# EAGLE design WeMos-TIC (EAGLE 7.7.0)
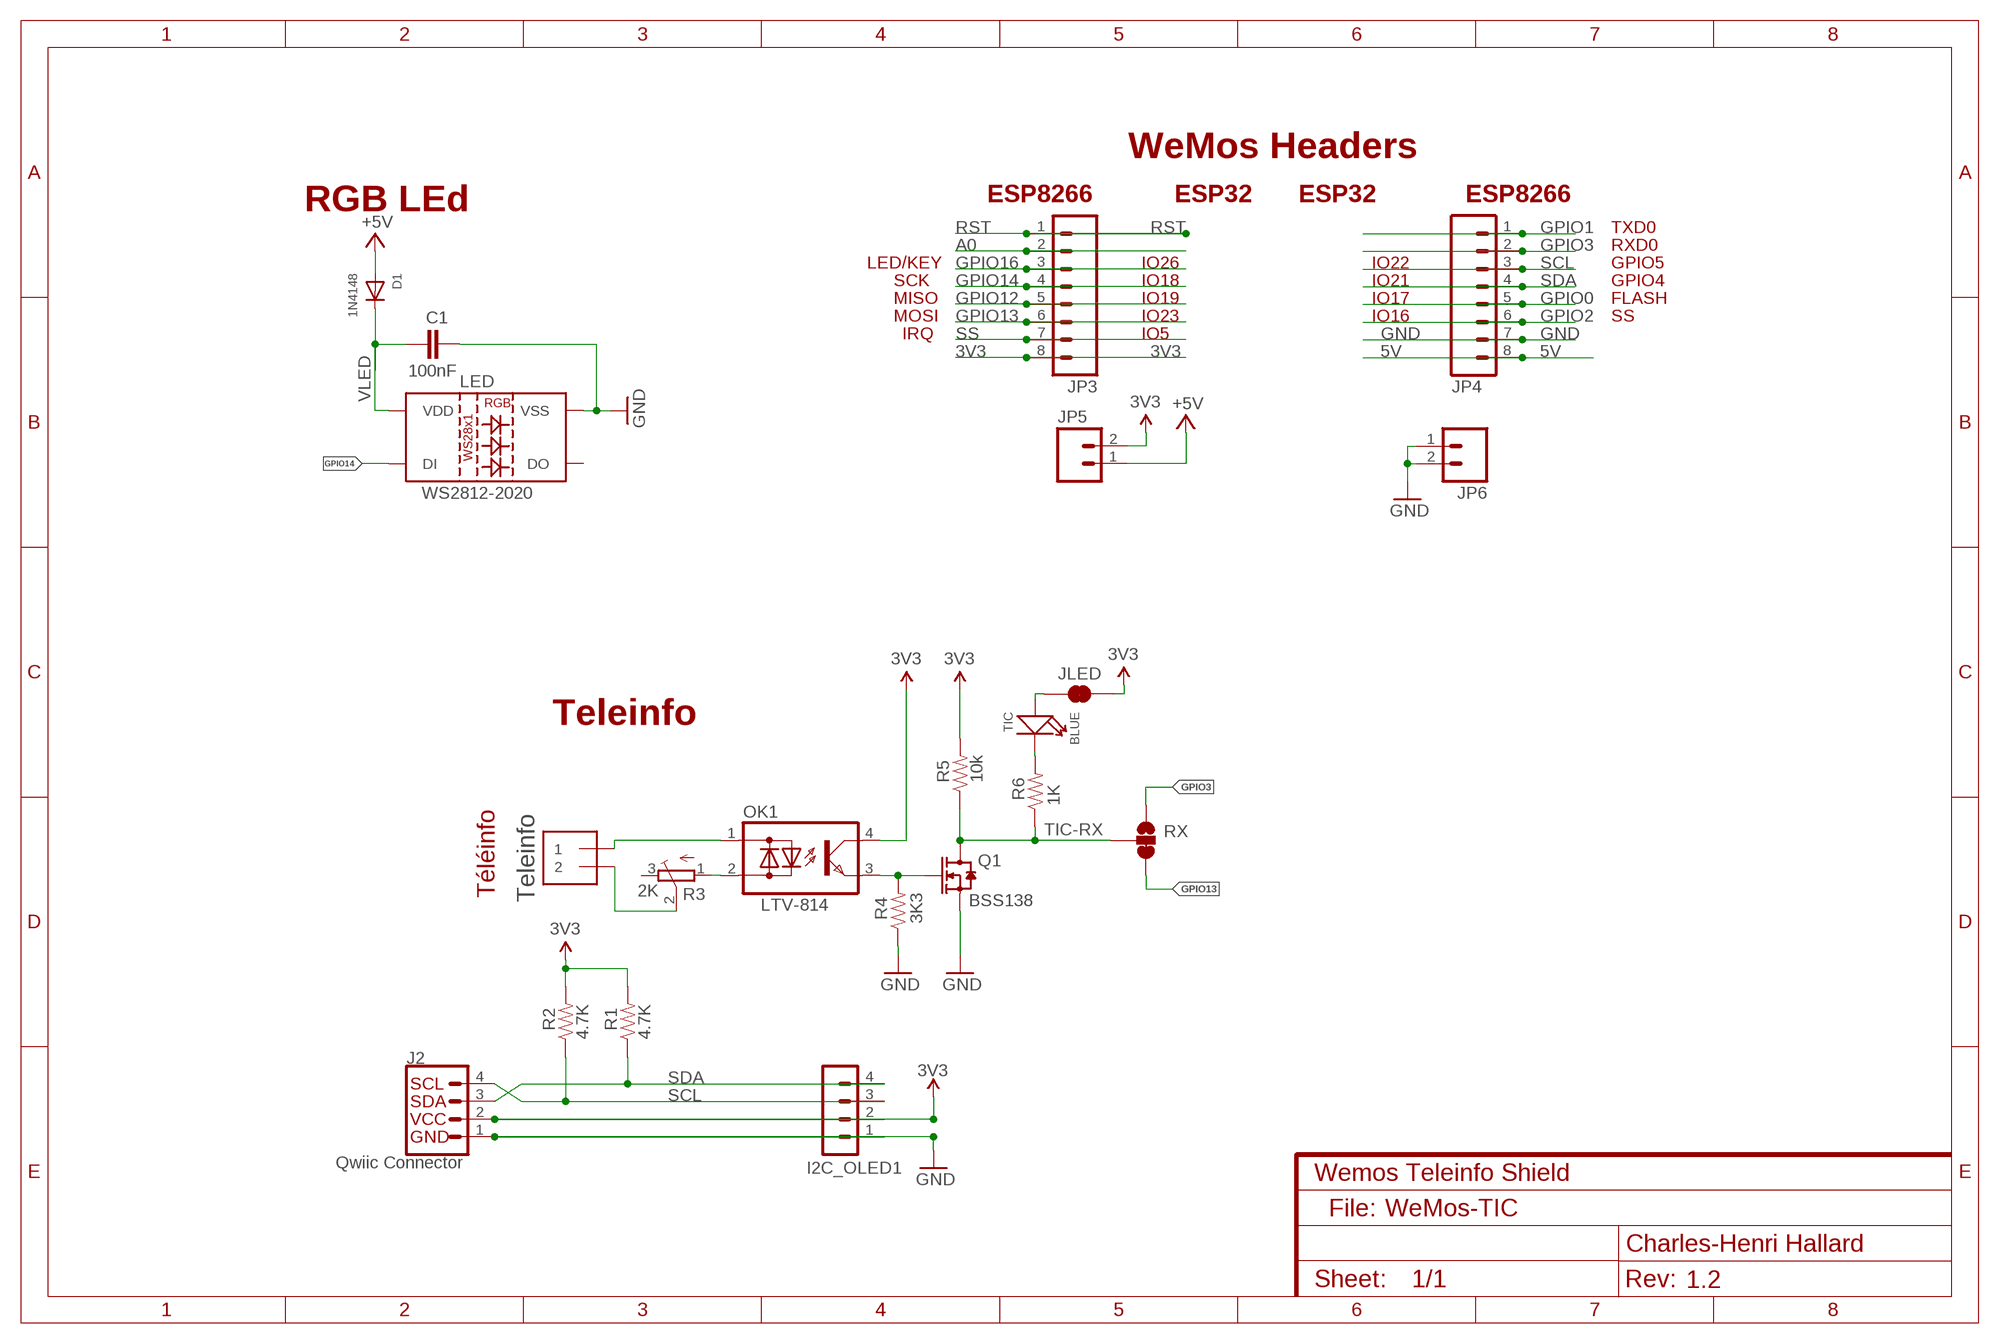
[diagram p0: schematic, sheet 1]
NAME (FRAME-A4L): CNAME: Wemos Teleinfo Shield; CREVISION: 1.2; DESIGNER: Charles-Henri Hallard

## Parts
C1  100nF  CAP0402-CAP-OK  [0402-CAP-OK]
D1  1N4148  DIODESOD-523  [SOD-523]
I2C_OLED1  CON_HEADER_1X04'SMALL''  [M1X4]
J1  KF2EDGR-3.81-2P  1X2-3.5MM-3.5MM  [1X2-3.5MM]
J2  Qwiic Connector  QWIIC_CONNECTOR  [JST04_1MM_VERT]
JLED  JUMPER-PAD-2-NC_BY_TRACE  [PAD-JUMPER-2-NC_BY_TRACE_YES_SILK]
JP3  M08NO_SILK_FEMALE_PTH  [1X08_NO_SILK]
JP4  M08NO_SILK_FEMALE_PTH  [1X08_NO_SILK]
JP5  M021X02_NO_SILK  [1X02_NO_SILK]
JP6  M021X02_NO_SILK  [1X02_NO_SILK]
LED  WS2812-2020  [WS2812-2020]
OK1  LTV-814  SFH6206  [DIL4-SMD]
Q1  BSS138  SMD-MOSFET-N-CH-20V-2.1A-CJ2302(SOT-23)  [SOT-323-3]
R1  4.7K  RESISTOR0402-RES  [0402-RES]
R2  4.7K  RESISTOR0402-RES  [0402-RES]
R3  2K  TRIMPOTTC33X  [TC33X]
R4  3K3  RESISTOR0402-RES  [0402-RES]
R5  10k  RESISTOR0402-RES  [0402-RES]
R6  1K  RESISTOR0402-RES  [0402-RES]
RX  TIC-RX  JUMPER-SMT_3_1-NC_TRACE_SILK  [SMT-JUMPER_3_1-NC_TRACE_SILK]
TIC  BLUE  SMD-LED-CLEAR-BLUE(0402)  [LED-0402]

## Nets
3V3: I2C_OLED1.2 J2.2 JLED.1 JP3.8 JP5.2 OK1.4(C) R1.2 R2.2 R5.2
5V: D1.A JP4.8 JP5.1 ; supply symbol labelled +5V
A0: JP3.2
GND: C1.1 I2C_OLED1.1 J2.1 JP4.7 JP6.1 JP6.2 LED.2(VSS) Q1.2(S) R4.1
GPIO0: JP4.5
GPIO1: JP4.1
GPIO2: JP4.6
GPIO3: JP4.2 RX.1
GPIO12: JP3.5
GPIO13: JP3.6 RX.3
GPIO14: JP3.4 LED.3(DI)
GPIO16: JP3.3
LTIC: JLED.2 TIC.+
N$1: R6.2 TIC.-
N$2: OK1.3(E) Q1.1(G) R4.2
N$3: OK1.2(AC2) R3.1(A)
N$4: J1.1 OK1.1(AC1)
N$5: J1.2 R3.2(S)
RST: JP3.1
SCL: I2C_OLED1.3 J2.4 JP4.3 R2.1
SDA: I2C_OLED1.4 J2.3 JP4.4 R1.1
SS: JP3.7
TIC-RX: Q1.3(D) R5.1 R6.1 RX.2
VLED: C1.2 D1.K(C) LED.4(VDD)
Unconnected: LED.1(DO) R3.3(E)

## Notes on the sheet
- WeMos Headers
- ESP8266 | ESP32 | ESP32 | ESP8266
- RGB LEd
- TXD0
- RXD0
- LED/KEY | IO26 | IO22 | GPIO5
- SCK | IO18 | IO21 | GPIO4
- MISO | IO19 | IO17 | FLASH
- MOSI | IO23 | IO16 | SS
- IRQ | IO5
- Teleinfo
- Téléinfo
- Teleinfo
- File:

## Library data of the parts
C1 = _c2h:CAP: Capacitor Standard 0603 ceramic capacitor, and 0.1" leaded capacitor.
D1 = microbuilder:DIODE: Diode SMA Model Volts Amps Type Vf Vr Digikey # Notes SSA34-E3 40V 3A Schottky 480mV @ 3A 200uA @ 40V SSA34-E3/61TGITR-ND CDBA120-G 20V 1A Schottky 500mV @ 1A 500uA @ 20V 641-1014-6-ND REEL MBRA210 10V 2A Schottky 350mV @ 2A 700uA @ 10V MBRA210LT3 SOD-123 Model Volts Amps Type Vf Vr Order # Notes BAT54T1G 30V 200mA Schottky 800mV @ 200mA 2uA @ 25V BAT54T1GOSTR-ND B0530W 30V 500mA Schottky 430mV @ 500mA 130uA @ 30V B0530W-FDICT-ND REEL MBR120 1A 20V Schottky 340mV @ 1A MBR120VLSFT1GOSCT-ND SOD-323 Model Volts Amps Type Vf Vr Order # Notes PMEG2005EJ 20V 500mA Schottky 355mV @ 500mA 568-4110-1-ND ZLLS410 10V 570mA Schottky 380mV @ 570mA ZLLS410CT-ND 1N4148WS 75V 150mA Silicon/Simple 1V 1N4148WSFSCT-ND REEL SOD-523 Model Volts Amps Type Vf Vr Order # Notes BAT54XV2 30V 200mA Schottky 0.8V @ 100mA BAT54XV2CT-ND TB751S 30V 30mA Schottky RB751S-40TE61CT-ND SOT23-R/W (R = Solder Paste/Reflow Ovens, W = Hand-Soldering) Model Volts Amps Type Vf Vr Order # Notes BAT54FILM 40V 300mA Schottky 497-7162-1-ND
I2C_OLED1 = _c2h:CON_HEADER_1X04
J1 = _c2h:1X2-3.5MM: 3.5mm Terminal block http://www.ladyada.net/library/pcb/eaglelibrary.html
J2 = _c2h:QWIIC_CONNECTOR: SparkFun I2C Standard Qwiic Connector An SMD 1mm pitch JST connector makes it easy and quick (get it? Qwiic?) to connect I2C devices to each other. The Qwiic system <http://www.sparkfun.com/qwiic> enables fast and solderless connection between popular platforms and various sensors and actuators. We carry 200mm <https://www.sparkfun.com/products/14204>, 100mm <https://www.sparkfun.com/products/14205>, 50mm <https://www.sparkfun.com/products/14206>, and breadboard friendly <https://www.sparkfun.com/products/14207> Qwiic cables. We also offer 10 pcs strips <https://www.sparkfun.com/products/14323> the SMD connectors.; PROD_ID: CONN-14483; VALUE: Vertical Qwiic Connector
JLED = SparkFun-Passives:JUMPER-PAD-2-NC_BY_TRACE
JP3 JP4 = SparkFun-Connectors:M08: Header 8 Standard 8-pin 0.1" header. Use with straight break away headers (SKU : PRT-00116), right angle break away headers (PRT-00553), swiss pins (PRT-00743), machine pins (PRT-00117), and female headers (PRT-00115).; PROD_ID: CONN-08438
JP5 JP6 = SparkFun-Connectors:M02: Standard 2-pin 0.1" header. Use with - straight break away headers ( PRT-00116) - right angle break away headers (PRT-00553) - swiss pins (PRT-00743) - machine pins (PRT-00117) - female headers (PRT-00115) Molex polarized connector foot print use with: PRT-08233 with associated crimp pins and housings. 2.54_SCREWTERM for use with PRT-10571. 3.5mm Screw Terminal footprints for PRT-08084 5mm Screw Terminal footprints for use with PRT-08432
LED = SparkFun-LED:WS2812-2020; PROD_ID: DIO-15591
OK1 = optocoupler:SFH620: Optocoupler, Phototransistor Output, AC Input Source: http://www.vishay.com/docs/83675/sfh620.pdf; MF: VISHAY/TELEFUNKEN; MPN: SFH6206-3; OC_FARNELL: 1469585; OC_NEWARK: 58K2214
Q1 = _c2h:SMD-MOSFET-N-CH-20V-2.1A-CJ2302(SOT-23): 305030015
R1 R2 R4-R6 = _c2h:RESISTOR: Resistor Basic schematic elements and footprints for 0603, 1206, and PTH resistors.
R3 = adafruit:TRIMPOT: SMT trimmer potentiometer part number TC33X http://www.ladyada.net/library/eagle
RX = SparkFun-Jumpers:JUMPER-SMT_3_1-NC_TRACE: Normally closed trace jumper (1 of 2 connections) This jumper has a trace between two pads so it's normally closed (NC). The other connection is normally open (NO). Use a razor knife to open the connection. For best results follow the IPC guidelines for cutting traces: Cutout at least 0.063 mm (0.005 in). Remove all loose material to clean up the cut area. Seal the cut with an approved epoxy. Reapply solder to reclose the connection, or to close the NO connection.
TIC = OPL_Optoelectronics:SMD-LED-CLEAR-BLUE(0402): 304090075; MPN: BL-HB337A-AV-TRB; VALUE: BLUE-0402

## Net classes
0 default: width 0.203 mm, drill 0.356 mm, clearance 0.152 mm
1 power: width 0.203 mm, clearance 0.152 mm

## Board
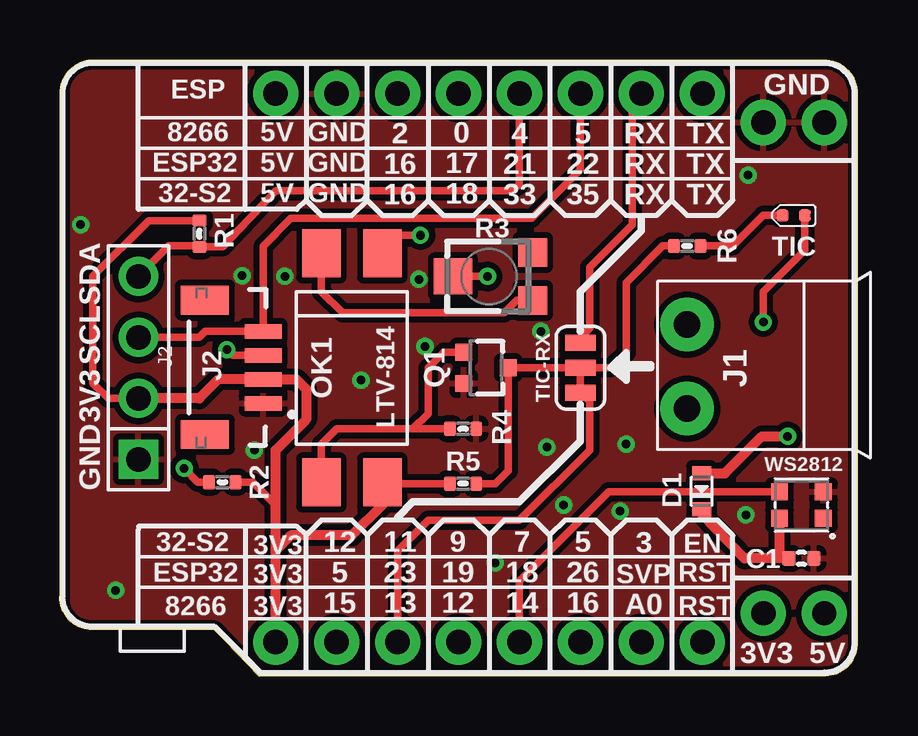
[diagram p1: board, top side]
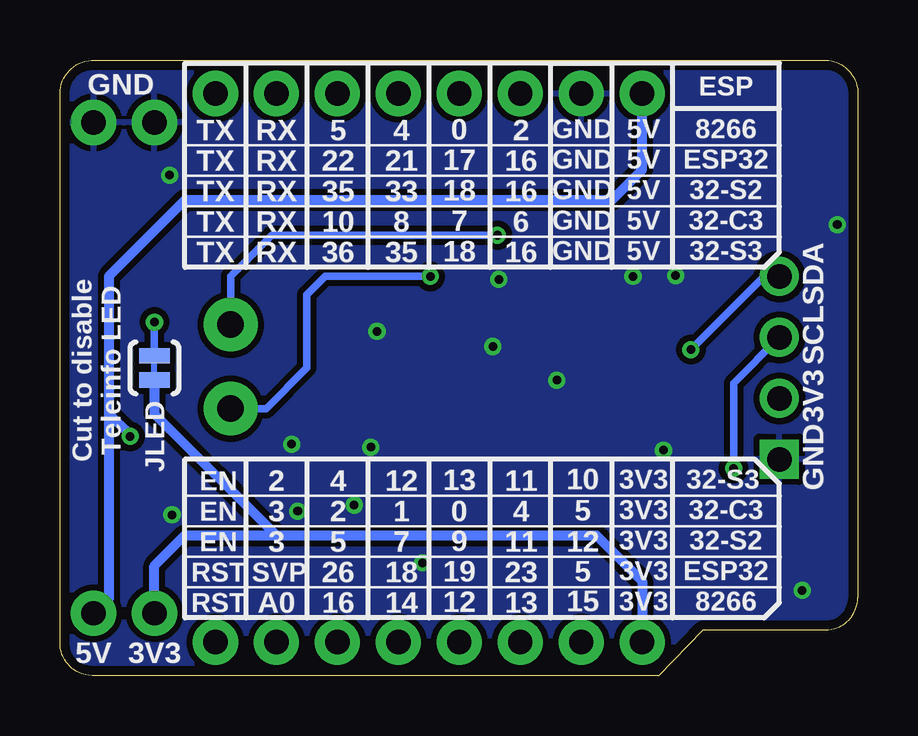
[diagram p2: board, bottom side, seen from below]

Size 33.24 x 25.65 mm. Coordinates in mm from the lower left corner, seen from the top.
Outline: 31.81,25.65 1.33,25.65 arc90 0,24.19 0,3.24 arc90 1.37,1.91 6.45,1.91 8.29,0 31.91,0 arc90 33.24,1.4 33.24,24.26 arc90 31.81,25.65
Copper layers (1*16): Top 0.0356mm / dielectric 1.5011mm / Bottom 0.0356mm
Design rules "PCBs_io": minimum track width 6mil, minimum drill 13mil, track to track 6mil, track to pad 6mil, pad to pad 6mil, via to via 6mil, smd to smd 6mil, copper to edge 15mil, drill to drill 6mil, minimum pad ring 7mil, minimum via ring 7mil, stop-mask expansion 3mil, vias tented up to drill 40mil, thermal gap 10mil

### Footprints (pad centres in the part's own frame; a part is rotated, then mirrored left to right if it is on the bottom)
0402-CAP-OK = smd 0.56 x 0.6: 1 -0.521,0; 2 0.525,0
SOD-523 = smd 0.8 x 0.6: A 0,-0.75; K 0,0.75
M1X4 = drill 1.02 pad 1.632 square: 1 -3.81,0 | drill 1.02 pad 1.632: 2 -1.27,0; 3 1.27,0; 4 3.81,0
1X2-3.5MM = drill 1.1 pad 2.235: 1 1.8,0; 2 -1.7,0
JST04_1MM_VERT = smd 0.6 x 1.55: 1 -1.478,0.775; 2 -0.478,0.775; 3 0.522,0.775; 4 1.522,0.775 | smd 1.2 x 2: NC1 -2.778,3.2; NC2 2.822,3.2
PAD-JUMPER-2-NC_BY_TRACE_YES_SILK = smd 0.635 x 1.27: 1 -0.508,0; 2 0.508,0
1X08_NO_SILK = drill 1.016 pad 1.88: 1 0,0; 2 2.54,0; 3 5.08,0; 4 7.62,0; 5 10.16,0; 6 12.7,0; 7 15.24,0; 8 17.78,0
1X02_NO_SILK = drill 1.016 pad 1.88: 1 0,0; 2 2.54,0
WS2812-2020 = smd 0.7 x 0.7: 1 0.915,-0.55; 2 0.915,0.55; 3 -0.915,0.55; 4 -0.915,-0.55
DIL4-SMD = smd 1.6 x 2: 1 -1.27,-4.77; 2 1.27,-4.77; 3 1.27,4.77; 4 -1.27,4.77
SOT-323-3 = smd 0.7 x 0.7: 1 -0.65,-0.925; 2 0.65,-0.925; 3 0,0.925
0402-RES = smd 0.5 x 0.6: 1 -0.55,0; 2 0.55,0
TC33X = smd 1.2 x 1.2: 1 -1,-1.825; 3 1,-1.825 | smd 1.5 x 1.6: 2 0,1.5
SMT-JUMPER_3_1-NC_TRACE_SILK = smd 0.66 x 1.27: 1 -1.041,0; 2 0,0; 3 1.041,0
LED-0402 = smd 0.5 x 0.5: + -0.463,0; - 0.463,0

### Placement (x,y rotation side)
C1  30.89,4.89 180 top
D1  26.73,7.68 180 top
I2C_OLED1  3.27,12.83 90 top
J1  26.13,12.83 90 top
J2  9.24,12.83 90 top
JLED  29.31,12.83 90 bottom
JP3  26.77,1.4 180 top
JP4  26.77,24.26 180 top
JP5  31.85,2.6 180 top
JP6  31.85,23.05 180 top
LED  30.89,7.11 0 top
OK1  12.16,12.83 180 top
Q1  17.75,12.83 270 top
R1  5.81,18.41 90 top
R2  6.76,8.06 0 top
R3  17.88,16.64 90 top
R4  16.8,10.29 180 top
R5  16.8,8 180 top
R6  26.13,17.91 0 top
RX  21.69,12.83 270 top
TIC  30.58,19.18 180 top

### Tracks (layer width: path | path; a pad name or v marks a point on that pad's centre or on a via)
3V3
  Top 0.305: I2C_OLED1.2 2,11.56 1.37,12.19 1.37,16.64 3.69,18.96 R1.2 | 13.95,8.57 OK1.4 13.49,8 R5.2 | R2.2 8.03,8.06 8.99,7.11
  Top 0.406: OK1.4 13.43,7.11 12.16,5.84 9.62,5.84 8.99,5.21 | I2C_OLED1.2 5.81,11.56 6.6,12.35 J2.2 9.84,12.35 10.26,11.94 10.26,10.67 8.99,9.4 8.99,7.11 8.99,5.21 | JP3.8 8.99,5.21
  Bottom 0.406: 24.23,5.84 29.31,10.92 JLED.1 | JP5.2 29.31,4.57 28.04,5.84 24.23,5.84 | 24.23,5.84 10.89,5.84 8.99,3.94 JP3.8
5V  (via drill 0.36)
  Top 0.406: v30.32,9.97 29.24,9.97 27.71,8.43 D1.A
  Bottom 0.406: 31.21,10.92 31.21,16.64 28.04,19.81 10.26,19.81 8.99,21.08 JP4.8 | 31.21,10.92 31.21,3.24 JP5.1 | v30.32,9.97 30.32,10.03 31.21,10.92
GND  (via drill 0.36 pad 0.71)
  other vias: 0.86,18.8 23.34,6.86 23.59,9.65 2.32,3.56 15.21,13.72 12.54,12.32 20.99,7.11 20.29,9.53 20.03,14.35 28.57,6.7 7.59,16.67 8.1,9.4 14.95,16.51 9.37,16.64 18.13,4.7 28.67,20.86
  pour Bottom (isolate 0.254): 34.39,26.8 34.39,-1.14 -1.17,-1.14 -1.17,26.8
  pour Top (isolate 0.254): -0.54,26.16 33.75,26.16 33.75,-0.51 -0.54,-0.51
GPIO3
  Top 0.305: RX.1 21.69,14.1 22.07,14.48 22.07,17.02 23.84,18.8 23.84,23.88 JP4.2
GPIO13
  Top 0.305: JP3.6 14.07,5.21 15.34,6.48 19.15,6.48 22.07,9.4 22.07,11.43 21.71,11.79 RX.3
GPIO14
  Top 0.305: LED.3 22.87,7.66 19.15,3.94 JP3.4
LTIC  (via drill 0.36)
  Top 0.305: v29.31,14.73 29.31,16 31.04,17.73 TIC.+
  Bottom 0.305: JLED.2 v29.31,14.73
N$1
  Top 0.305: R6.2 28.04,17.91 29.31,19.18 TIC.-
N$2
  Top 0.305: OK1.3 10.89,9.65 11.53,10.29 14.7,10.29 | 14.7,10.29 R4.2 | 14.7,10.29 15.34,10.92 15.34,12.83 15.99,13.48 Q1.1
N$3
  Top 0.305: 10.26,17.27 10.57,17.27 OK1.2 10.89,16 11.78,15.11 18.51,15.11 19.03,15.64 R3.1
N$4  (via drill 0.36 pad 0.71)
  Top 0.305: v15.02,18.35 14.18,18.35 OK1.1
  Bottom 0.305: v15.02,18.35 24.42,18.35 26.13,16.64 J1.1
N$5  (via drill 0.36)
  Top 0.305: R3.2 v17.81,16.64
  Bottom 0.305: v17.81,16.64 22.19,16.64 22.96,15.88 22.96,12.83 24.66,11.13 J1.2
SCL  (via drill 0.36)
  Top 0.305: R2.1 5.75,8.06 v5.18,8.64 | I2C_OLED1.3 5.81,14.1 6.06,14.35 J2.4 8.46,17.89 9.62,19.05 19.65,19.05 21.69,21.08 JP4.3
  Bottom 0.305: v5.18,8.64 5.18,12.19 I2C_OLED1.3
SDA  (via drill 0.36)
  Top 0.305: I2C_OLED1.4 4.54,17.91 5.77,17.91 R1.1 6.77,17.86 8.99,20.21 18.78,20.21 19.15,20.45 JP4.4 | J2.3 7.19,13.35 v6.95,13.59
  Bottom 0.305: v6.95,13.59 3.91,16.64 I2C_OLED1.4
TIC-RX
  Top 0.305: R6.1 25.11,17.91 23.59,16.38 23.59,13.46 22.96,12.83 RX.2 Q1.3 18.67,8.54 18.13,8 R5.1
VLED
  Top 0.406: LED.4 29.98,5.08 C1.2 28.51,4.89 26.73,6.73 D1.K

### Text on the board
tNames: GND | ESP | 8266 | 5V | GND | 0 | 2 | 4 | 5 | RX | TX | ESP32 | 5V | GND | 16 | 17 | 21 | 22 | RX | TX | 32-S2 | 5V | GND | 16 | 18 | 33 | 35 | RX | TX | SDA | SCL | J2 | 3V3 | GND | WS2812 | 32-S2 | 3V3 | 12 | 11 | 9 | 7 | 5 | 3 | EN | ESP32 | 3V3 | 5 | 23 | 19 | 18 | 26 | SVP | RST | 8266 | 3V3 | 15 | 13 | 12 | 14 | 16 | A0 | RST | 3V3 | 5V
bNames: GND | ESP | 8266 | 5V | GND | 2 | 0 | 4 | 5 | RX | TX | ESP32 | 5V | GND | 16 | 17 | 21 | 22 | RX | TX | 32-S2 | 5V | GND | 16 | 18 | 33 | 35 | RX | TX | 32-C3 | 5V | GND | 6 | 7 | 8 | 10 | RX | TX | 32-S3 | 5V | GND | 16 | 18 | 35 | 36 | RX | TX | SDA | SCL | Cut to disable / Teleinfo LED | 3V3 | GND | 32-S3 | 3V3 | 10 | 11 | 13 | 12 | 4 | 2 | EN | 32-C3 | 3V3 | 5 | 4 | 0 | 1 | 2 | 3 | EN | 32-S2 | 3V3 | 12 | 11 | 9 | 7 | 5 | 3 | EN | ESP32 | 3V3 | 5 | 23 | 19 | 18 | 26 | SVP | RST | 8266 | 3V3 | 15 | 13 | 12 | 14 | 16 | A0 | RST | 3V3 | 5V
tStop: WeMos / Teleinfo | V1.2 | hallard.me
bStop: V1.2 | WeMos / Teleinfo | hallard.me/teleinfo